# EAGLE design led-segment-display (EAGLE 7.7.0)
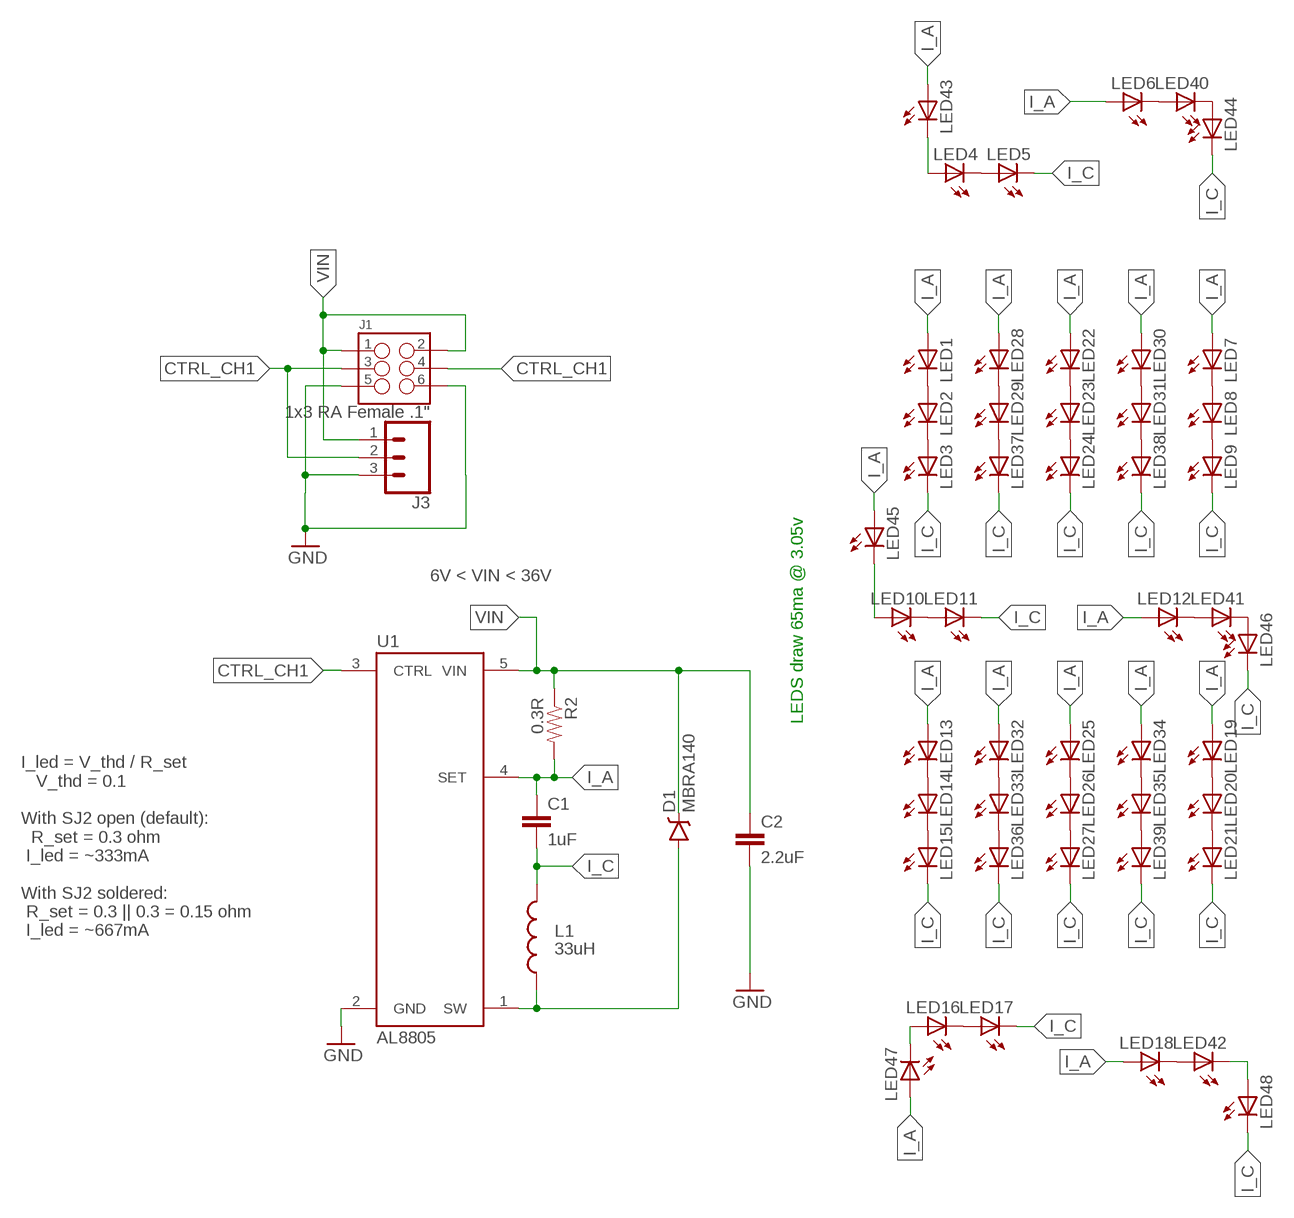
[diagram p0: schematic, sheet 1]

## Parts
C1  1uF  1.0UF50V10%(1206)  [1206-CAP]
C2  2.2uF  2.2UF50V10%(1206)  [1206-CAP]
D1  MBRA140  DIODE-SCHOTTKY-MBRA140  [SMA-DIODE]
J1  M03X2SMD  [2X3_SMD_2.54MM]
J3  1x3 RA Female .1"  CONN_03SMD_RA_2.54MM  [1X3_SMD_2.54MM]
L1  33uH  INDUCTORBOURNS_SRN6045  [SRN6045]
LED1  LED3014  [LED-3014]
LED2  LED3014  [LED-3014]
LED3  LED3014  [LED-3014]
LED4  LED3014  [LED-3014]
LED5  LED3014  [LED-3014]
LED6  LED3014  [LED-3014]
LED7  LED3014  [LED-3014]
LED8  LED3014  [LED-3014]
LED9  LED3014  [LED-3014]
LED10  LED3014  [LED-3014]
LED11  LED3014  [LED-3014]
LED12  LED3014  [LED-3014]
LED13  LED3014  [LED-3014]
LED14  LED3014  [LED-3014]
LED15  LED3014  [LED-3014]
LED16  LED3014  [LED-3014]
LED17  LED3014  [LED-3014]
LED18  LED3014  [LED-3014]
LED19  LED3014  [LED-3014]
LED20  LED3014  [LED-3014]
LED21  LED3014  [LED-3014]
LED22  LED3014  [LED-3014]
LED23  LED3014  [LED-3014]
LED24  LED3014  [LED-3014]
LED25  LED3014  [LED-3014]
LED26  LED3014  [LED-3014]
LED27  LED3014  [LED-3014]
LED28  LED3014  [LED-3014]
LED29  LED3014  [LED-3014]
LED30  LED3014  [LED-3014]
LED31  LED3014  [LED-3014]
LED32  LED3014  [LED-3014]
LED33  LED3014  [LED-3014]
LED34  LED3014  [LED-3014]
LED35  LED3014  [LED-3014]
LED36  LED3014  [LED-3014]
LED37  LED3014  [LED-3014]
LED38  LED3014  [LED-3014]
LED39  LED3014  [LED-3014]
LED40  LED3014  [LED-3014]
LED41  LED3014  [LED-3014]
LED42  LED3014  [LED-3014]
LED43  LED3014  [LED-3014]
LED44  LED3014  [LED-3014]
LED45  LED3014  [LED-3014]
LED46  LED3014  [LED-3014]
LED47  LED3014  [LED-3014]
LED48  LED3014  [LED-3014]
R2  0.3R  0.3OHM-1/8W-1%(0805)  [0805]
U1  AL8805  [SOT23-5]

## Nets
CTRL_CH1: J1.3 J1.4 J3.2 U1.3(CTRL)
GND: C2.2 J1.5 J1.6 J3.3 U1.2(GND)
I_A: C1.1 LED1.A LED6.A LED7.A LED12.A LED13.A LED18.A LED19.A LED22.A LED25.A LED28.A LED30.A LED32.A LED34.A LED43.A LED45.A LED47.A R2.2 U1.4(SET)
I_C: C1.2 L1.2 LED3.C LED5.C LED9.C LED11.C LED15.C LED17.C LED21.C LED24.C LED27.C LED36.C LED37.C LED38.C LED39.C LED44.C LED46.C LED48.C
N$1: LED1.C LED2.A
N$2: LED2.C LED3.A
N$3: LED4.C LED5.A
N$4: LED4.A LED43.C
N$5: LED7.C LED8.A
N$6: LED8.C LED9.A
N$7: LED10.C LED11.A
N$8: LED40.C LED44.A
N$9: LED13.C LED14.A
N$10: LED14.C LED15.A
N$11: LED16.C LED17.A
N$12: LED42.C LED48.A
N$13: LED19.C LED20.A
N$14: LED20.C LED21.A
N$15: LED22.C LED23.A
N$16: LED23.C LED24.A
N$17: LED25.C LED26.A
N$18: LED26.C LED27.A
N$19: LED28.C LED29.A
N$20: LED30.C LED31.A
N$21: LED32.C LED33.A
N$22: LED34.C LED35.A
N$23: LED33.C LED36.A
N$24: LED29.C LED37.A
N$25: LED31.C LED38.A
N$26: LED35.C LED39.A
N$27: LED6.C LED40.A
N$28: LED12.C LED41.A
N$29: LED18.C LED42.A
N$34: LED16.A LED47.C
N$35: LED10.A LED45.C
N$36: LED41.C LED46.A
SW: D1.A L1.1 U1.1(SW)
VIN: C2.1 D1.C J1.1 J1.2 J3.1 R2.1 U1.5(VIN)

## Notes on the sheet
- 6V < VIN < 36V
- LEDS draw 65ma @ 3.05v
- I_led = V_thd / R_set
     V_thd = 0.1
  
  With SJ2 open (default):
    R_set = 0.3 ohm
   I_led = ~333mA
  
  With SJ2 soldered:
   R_set = 0.3 || 0.3 = 0.15 ohm
   I_led = ~667mA

## Library data of the parts
C1 = SparkFun-Capacitors:1.0UF50V10%(1206): CAP-09822
C2 = SparkFun-Capacitors:2.2UF50V10%(1206): CAP-10009
D1 = SparkFun-DiscreteSemi:DIODE-SCHOTTKY: Schottky diodes in SFE's production catalog BAT20J 1A 23V 0.62Vf RB751 120mA 40V 0.37Vf PMEG4005EJ 0.5A 40V 0.42Vf MBRA140 1A 40V 0.5Vf B340A 3A 40V SMA; PROD_ID: DIO-08053
J1 = mechanical:M03X2: 2x3 .1" header. Shrouded, with keying- CONN-10681 SMT- CONN-11415 Pogo pins- HW-11044
J3 = mechanical:CONN_03: Multi connection point. Often used as Generic Header-pin footprint for 0.1 inch spaced/style header connections On any of the 0.1 inch spaced packages, you can populate with these: Break Away Headers - Straight <https://www.sparkfun.com/products/116> (PRT-00116) Break Away Male Headers - Right Angle <https://www.sparkfun.com/products/553> (PRT-00553) Female Headers <https://www.sparkfun.com/products/115> (PRT-00115) Break Away Headers - Machine Pin <https://www.sparkfun.com/products/117> (PRT-00117) Break Away Female Headers - Swiss Machine Pin <https://www.sparkfun.com/products/743> (PRT-00743) Stackable Header - 3 Pin (Female, 0.1") <https://www.sparkfun.com/products/13875> (PRT-13875) For SCREWTERMINALS and SPRING TERMINALS visit here: Screw Terimnals on SparkFun.com <https://www.sparkfun.com/search/results?term=Screw+Terminals> (5mm/3.5mm/2.54mm spacing) This device is also useful as a general connection point to wire up your design to another part of your project. Our various solder wires solder well into these plated through hole pads. Hook-Up Wire - Assortment (Stranded, 22 AWG) <https://www.sparkfun.com/products/11375> (PRT-11375) Hook-Up Wire - Assortment (Solid Core, 22 AWG) <https://www.sparkfun.com/products/11367> (PRT-11367) View the entire wire category on our website here <https://www.sparkfun.com/categories/141> Special notes: Molex polarized connector foot print use with SKU : PRT-08232 with associated crimp pins and housings.
L1 = SparkFun-Passives:INDUCTOR: Inductors Basic Inductor/Choke - 0603 and 1206. Footprints are not proven and vary greatly between part numbers. INDUCTOR POWER 3.3UH 4.0A SMD 0.197" L x 0.197" W x 0.177" H (5.00mm x 5.00mm x 4.50mm); PROD_ID: NDUC-11627
LED1-LED48 = semiconductors:LED: Light Emitting Diode
R2 = SparkFun-Resistors:0.3OHM-1/8W-1%(0805): RES-11622; PROD_ID: RES-11622; VALUE: 0.3
U1 = SparkFun-PowerIC:AL8805: Constant current LED driver PWM-able 1MHz switch freq 6V-36V Up to 1A LED current; PROD_ID: IC-11626; VALUE: AL8805WS

## Net classes
0 default: width 0.254 mm
1 power: width 0.508 mm

## Board
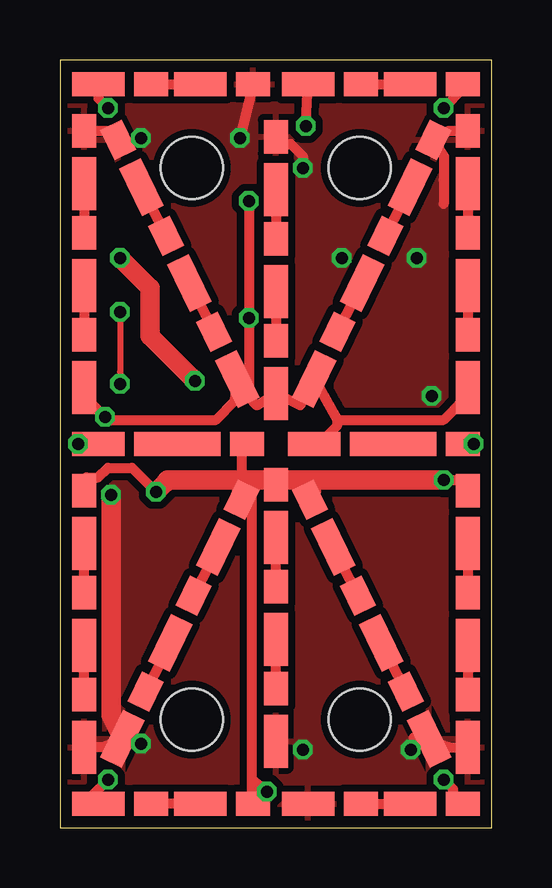
[diagram p1: board, top side]
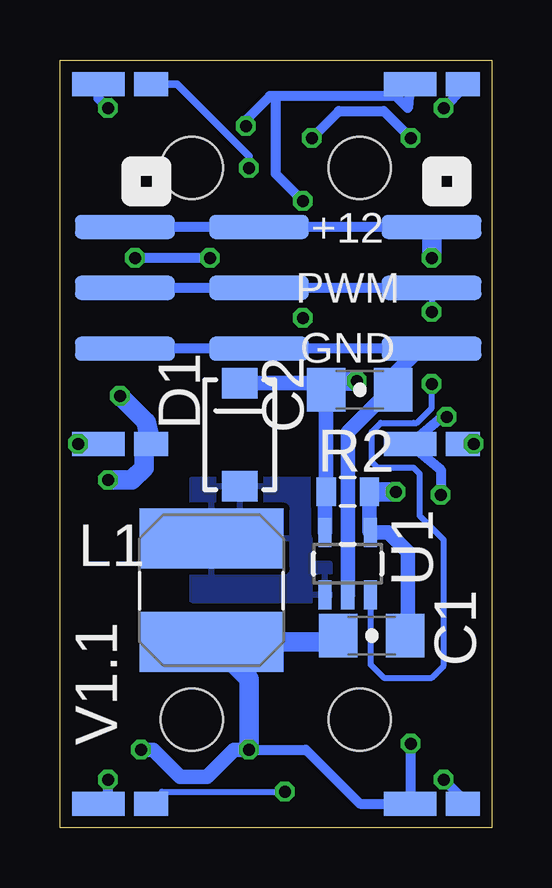
[diagram p2: board, bottom side, seen from below]

Size 18 x 32 mm. Coordinates in mm from the lower left corner, seen from the top.
Outline: 0,0 18,0 18,32 0,32 0,0
Copper layers (1*16): Top 0.035mm / dielectric 1.5mm / Bottom 0.035mm
Design rules "dirt_cheap_dirty_boards.v1.1": minimum track width 5mil, minimum drill 12mil, track to track 5mil, track to pad 5mil, pad to pad 5mil, via to via 5mil, smd to smd 0mil, copper to edge 10mil, drill to drill 10mil, minimum pad ring 10mil, minimum via ring 6mil, stop-mask expansion 2mil, vias tented up to drill 25mil, thermal gap 10mil
Holes 2.6 mm at 5.5,27.5 12.5,27.5 5.5,4.5 12.5,4.5

### Footprints (pad centres in the part's own frame; a part is rotated, then mirrored left to right if it is on the bottom)
1206-CAP = smd 1.6 x 1.8: 1 -1.4,0; 2 1.4,0
SMA-DIODE = smd 1.27 x 1.47: A -2.15,0; C 2.15,0
2X3_SMD_2.54MM = smd 4.15 x 1: 1 -2.794,2.54; 2 2.794,2.54; 3 -2.794,0; 4 2.794,0; 5 -2.794,-2.54; 6 2.794,-2.54
1X3_SMD_2.54MM = smd 4.15 x 1: 1 0,2.54; 2 0,0; 3 0,-2.54
SRN6045 = smd 2.5 x 6: 1 -2.175,-0.175; 2 2.125,-0.175
LED-3014 = smd 1.4 x 1: A 1.3,0 | smd 2.2 x 1: C -0.9,0
0805 = smd 0.8 x 1.2: 1 -0.9,0; 2 0.9,0
SOT23-5 = smd 0.55 x 1.2: 1 -0.95,-1.3; 2 0,-1.3; 3 0.95,-1.3; 4 0.95,1.3; 5 -0.95,1.3

### Placement (x,y rotation side)
C1  5,8 180 bottom
C2  5.5,18.25 0 bottom
D1  10.5,16.38 90 bottom
J1  12.5,22.5 0 bottom
J3  2.5,22.5 0 bottom
L1  11.5,9.88 270 bottom
LED1  1,27.75 90 top
LED2  1,23.5 90 top
LED3  1,19.25 90 top
LED4  15.5,31 0 top
LED5  11.25,31 0 top
LED6  6.75,31 0 top
LED7  17,27.75 90 top
LED8  17,23.5 90 top
LED9  17,19.25 90 top
LED10  15.5,16 0 top
LED11  11.5,16 0 top
LED12  6.5,16 0 top
LED13  1,12.75 90 top
LED14  1,8.5 90 top
LED15  1,4.25 90 top
LED16  15.5,1 0 top
LED17  11.25,1 0 top
LED18  6.75,1 0 top
LED19  17,12.75 90 top
LED20  17,8.5 90 top
LED21  17,4.25 90 top
LED22  9,27.5 90 top
LED23  9,23.25 90 top
LED24  9,19 90 top
LED25  9,13 90 top
LED26  9,8.75 90 top
LED27  9,4.5 90 top
LED28  3,27.5 116 top
LED29  5,23.5 116 top
LED30  15,27.5 64 top
LED31  13,23.5 64 top
LED32  7,12.5 64 top
LED33  5,8.5 64 top
LED34  11,12.5 116 top
LED35  13,8.5 116 top
LED36  3,4.5 64 top
LED37  7,19.5 116 top
LED38  11,19.5 64 top
LED39  15,4.5 116 top
LED40  2.5,31 0 top
LED41  2.5,16 0 top
LED42  2.5,1 0 top
LED43  15.5,31 0 bottom
LED44  2.5,31 0 bottom
LED45  15.5,16 0 bottom
LED46  2.5,16 0 bottom
LED47  15.5,1 0 bottom
LED48  2.5,1 0 bottom
R2  6,14 0 bottom
U1  6,11 0 bottom

### Tracks (layer width: path | path; a pad name or v marks a point on that pad's centre or on a via)
CTRL_CH1  (via drill 0.5)
  Top 0.254: v2.5,21.5 2.5,19 v2.5,18.5
  Bottom 0.254: J3.2 v2.5,21.5 | U1.3 5.05,6.8 4.5,6.25 2.5,6.25 2,6.75 2,12 3,13 3,14.75 3.25,15 4.75,15 5,15.25 5,16.5 4.62,16.88 3.25,16.88 3.12,16.88 2.5,17.5 v2.5,18.5
  Bottom 0.406: J3.2 J1.4 J1.3
GND
  Bottom 0.406: J3.3 3,19.96 J1.6 J1.5
  Bottom 0.61: 3,19.96 4.1,18.86 C2.2 4.1,17.9 4.75,17.75 6,16.5 U1.2
I_A  (via drill 0.5)
  Top 0.406: 16,26 16,27 16.01,27.99 LED30.A 16.2,29.05 LED7.A | 8,2 v8.62,1.5 8.55,1.5 LED18.A 8,1.05 8,14.5 | LED6.A 7.6,29.1 | LED22.A 9.1,28.5 9.62,28.5 10.12,28 v10.12,27.5 | LED13.A 1.1,14.6 1.6,14.6 2,15 3,15 v4,14 | 7.6,14.61 LED32.A 7.57,15.77 LED12.A | v16,14.49 16.89,14.49 LED19.A | LED1.A 2.05,29.05 LED28.A | 4.5,14.5 4.38,14.38
  Top 0.813: v4,14 4.38,14.38 4.49,14.49 | 7.57,14.18 LED32.A 7.9,14.5 | v16,14.49 v15.99,14.5 10.5,14.5 | 10.5,14.5 9,14.5 | 9,14.5 8,14.5 7.9,14.5 | 7.9,14.5 4.5,14.5 | 10.5,14.24 LED34.A 10.43,14.43 10.5,14.5 | LED25.A 9,14.5
  Bottom 0.254: LED47.A 13.75,1.5 v8.62,1.5
  Bottom 0.305: LED43.A 13.12,31 10.12,28 v10.12,27.5
  Bottom 0.406: v11.75,23.75 v14.88,23.75 | LED45.A 14.5,15.9 | v7.5,28.75 6.38,29.88 4.5,29.88 v3.38,28.75
  Bottom 0.61: R2.2 5.1,12.35 U1.4 4.3,12.3 3.5,11.5 3.5,7.6 C1.1
  Bottom 0.813: LED45.A 14.4,16.9 v15.5,18 | 14.5,15.9 14.5,15 15.01,14.49 v16,14.49 | R2.2 v4,14
  pour Top (isolate 0.305): 0,32 18,32 18,17 0,17
I_C  (via drill 0.5)
  Top 0.406: LED37.C 7.31,17.81 6.5,17 2,17 v1.88,17.12 1,18 LED3.C | LED37.C 7.38,17.8 | LED24.C 9.07,17.87 | 11.56,17 LED38.C 10.01,17.6 LED24.C | 11.56,17 16,17 16.8,17.8 LED9.C | 11.56,17 11.56,16.76 10.8,16 LED11.C | v10.25,29.25 10.25,29.45 LED5.C | v14.62,3.25 14.75,3.38 14.75,3.75 | v7.88,26.12 v7.88,21.25 7.88,17.94 | LED37.C 7.65,17.94 7.88,17.94 | 7.88,17.94 8.21,17.6 LED24.C | LED39.C 16.24,3.35 LED21.C | LED36.C 1.76,3.35 LED15.C
  Top 0.813: v2.12,13.88 2.12,4.67 LED36.C
  Bottom 0.406: v3.38,3.5 3.38,1.02 LED48.C 5.5,1 7.75,3.25 v10.12,3.25 | v2.12,13.88 2.12,14.93 LED46.C 2.08,17.12 v1.88,17.12 | LED44.C 3.5,30 4,30.5 9,30.5 | 9,30.5 9.25,30.5 10.25,29.5 v10.25,29.25 | v7.88,26.12 9,27.25 9,30.5
  Bottom 0.61: v10.12,3.25 10.75,3.25 11.88,2.12 13,2.12 14.12,3.25 v14.62,3.25
  Bottom 0.813: C1.2 6.65,7.75 L1.2 10.12,6.2 v10.12,3.25
  pour Top (isolate 0.305): 0,0 18,0 18,15 0,15
N$1
  Top 0.406: LED1.C LED2.A
N$2
  Top 0.406: LED2.C LED3.A
N$3
  Top 0.406: LED5.A LED4.C
N$4  (via drill 0.5)
  Top 0.406: LED4.A 16.8,30.8 v16,30
  Bottom 0.406: LED43.C 16.4,30.4 v16,30
N$5
  Top 0.406: LED7.C LED8.A
N$6
  Top 0.406: LED8.C LED9.A
N$7
  Top 0.406: LED11.A LED10.C
N$8  (via drill 0.5)
  Top 0.406: LED40.C 1.6,30.4 v2,30
  Bottom 0.406: LED44.A 1.2,30.8 v2,30
N$9
  Top 0.406: LED14.A LED13.C
N$10
  Top 0.406: LED15.A LED14.C
N$11
  Top 0.406: LED17.A LED16.C
N$12  (via drill 0.5)
  Top 0.406: LED42.C 1.35,1.35 v2,2
  Bottom 0.406: LED48.A 1.2,1.2 v2,2
N$13
  Top 0.406: LED19.C LED20.A
N$14
  Top 0.406: LED20.C LED21.A
N$15
  Top 0.406: LED22.C LED23.A
N$16
  Top 0.406: LED23.C LED24.A
N$17
  Top 0.406: LED26.A LED25.C
N$18
  Top 0.406: LED27.A LED26.C
N$19
  Top 0.406: LED28.C LED29.A
N$20
  Top 0.406: LED30.C LED31.A
N$21
  Top 0.406: LED32.C LED33.A
N$22
  Top 0.406: LED34.C LED35.A
N$23
  Top 0.406: LED33.C LED36.A
N$24
  Top 0.406: LED29.C LED37.A
N$25
  Top 0.406: LED31.C LED38.A
N$26
  Top 0.406: LED35.C LED39.A
N$27
  Top 0.406: LED40.A LED6.C
N$28
  Top 0.406: LED41.A LED12.C
N$29
  Top 0.406: LED18.C LED42.A
N$34  (via drill 0.5)
  Top 0.406: LED16.A LED47.C 16.4,1.6 v16,2
  Bottom 0.406: LED47.C 16,1.15 v16,2
N$35  (via drill 0.5)
  Top 0.406: LED10.A v17.25,16
  Bottom 0.406: v17.25,16 LED45.C
N$36  (via drill 0.5)
  Top 0.406: v0.75,16 LED41.C
  Bottom 0.406: LED46.A v0.75,16
SW
  pour Bottom (isolate 0.254): 6.75,11 7.5,11 7.5,14.5 12.5,14.5 12.5,9.5 6.75,9.5
VIN  (via drill 0.5)
  Top 0.813: v2.5,23.75 3.75,22.5 3.75,20.5 v5.62,18.62
  Bottom 0.406: J3.1 J1.2 J1.1 | 6.88,18.62 C2.1
  Bottom 0.61: U1.5 6.95,14.45 R2.1 C2.1 7.67,18.52 D1.C
  Bottom 0.813: J3.1 v2.5,23.75 | v5.62,18.62 6.88,18.62

### Text on the board
bNames: +12 | PWM | GND | V1.1
tDocu: arctan(2/1) = 64 degrees